# Altium project radxa_cm3s_io_board_v1510.PrjPcb
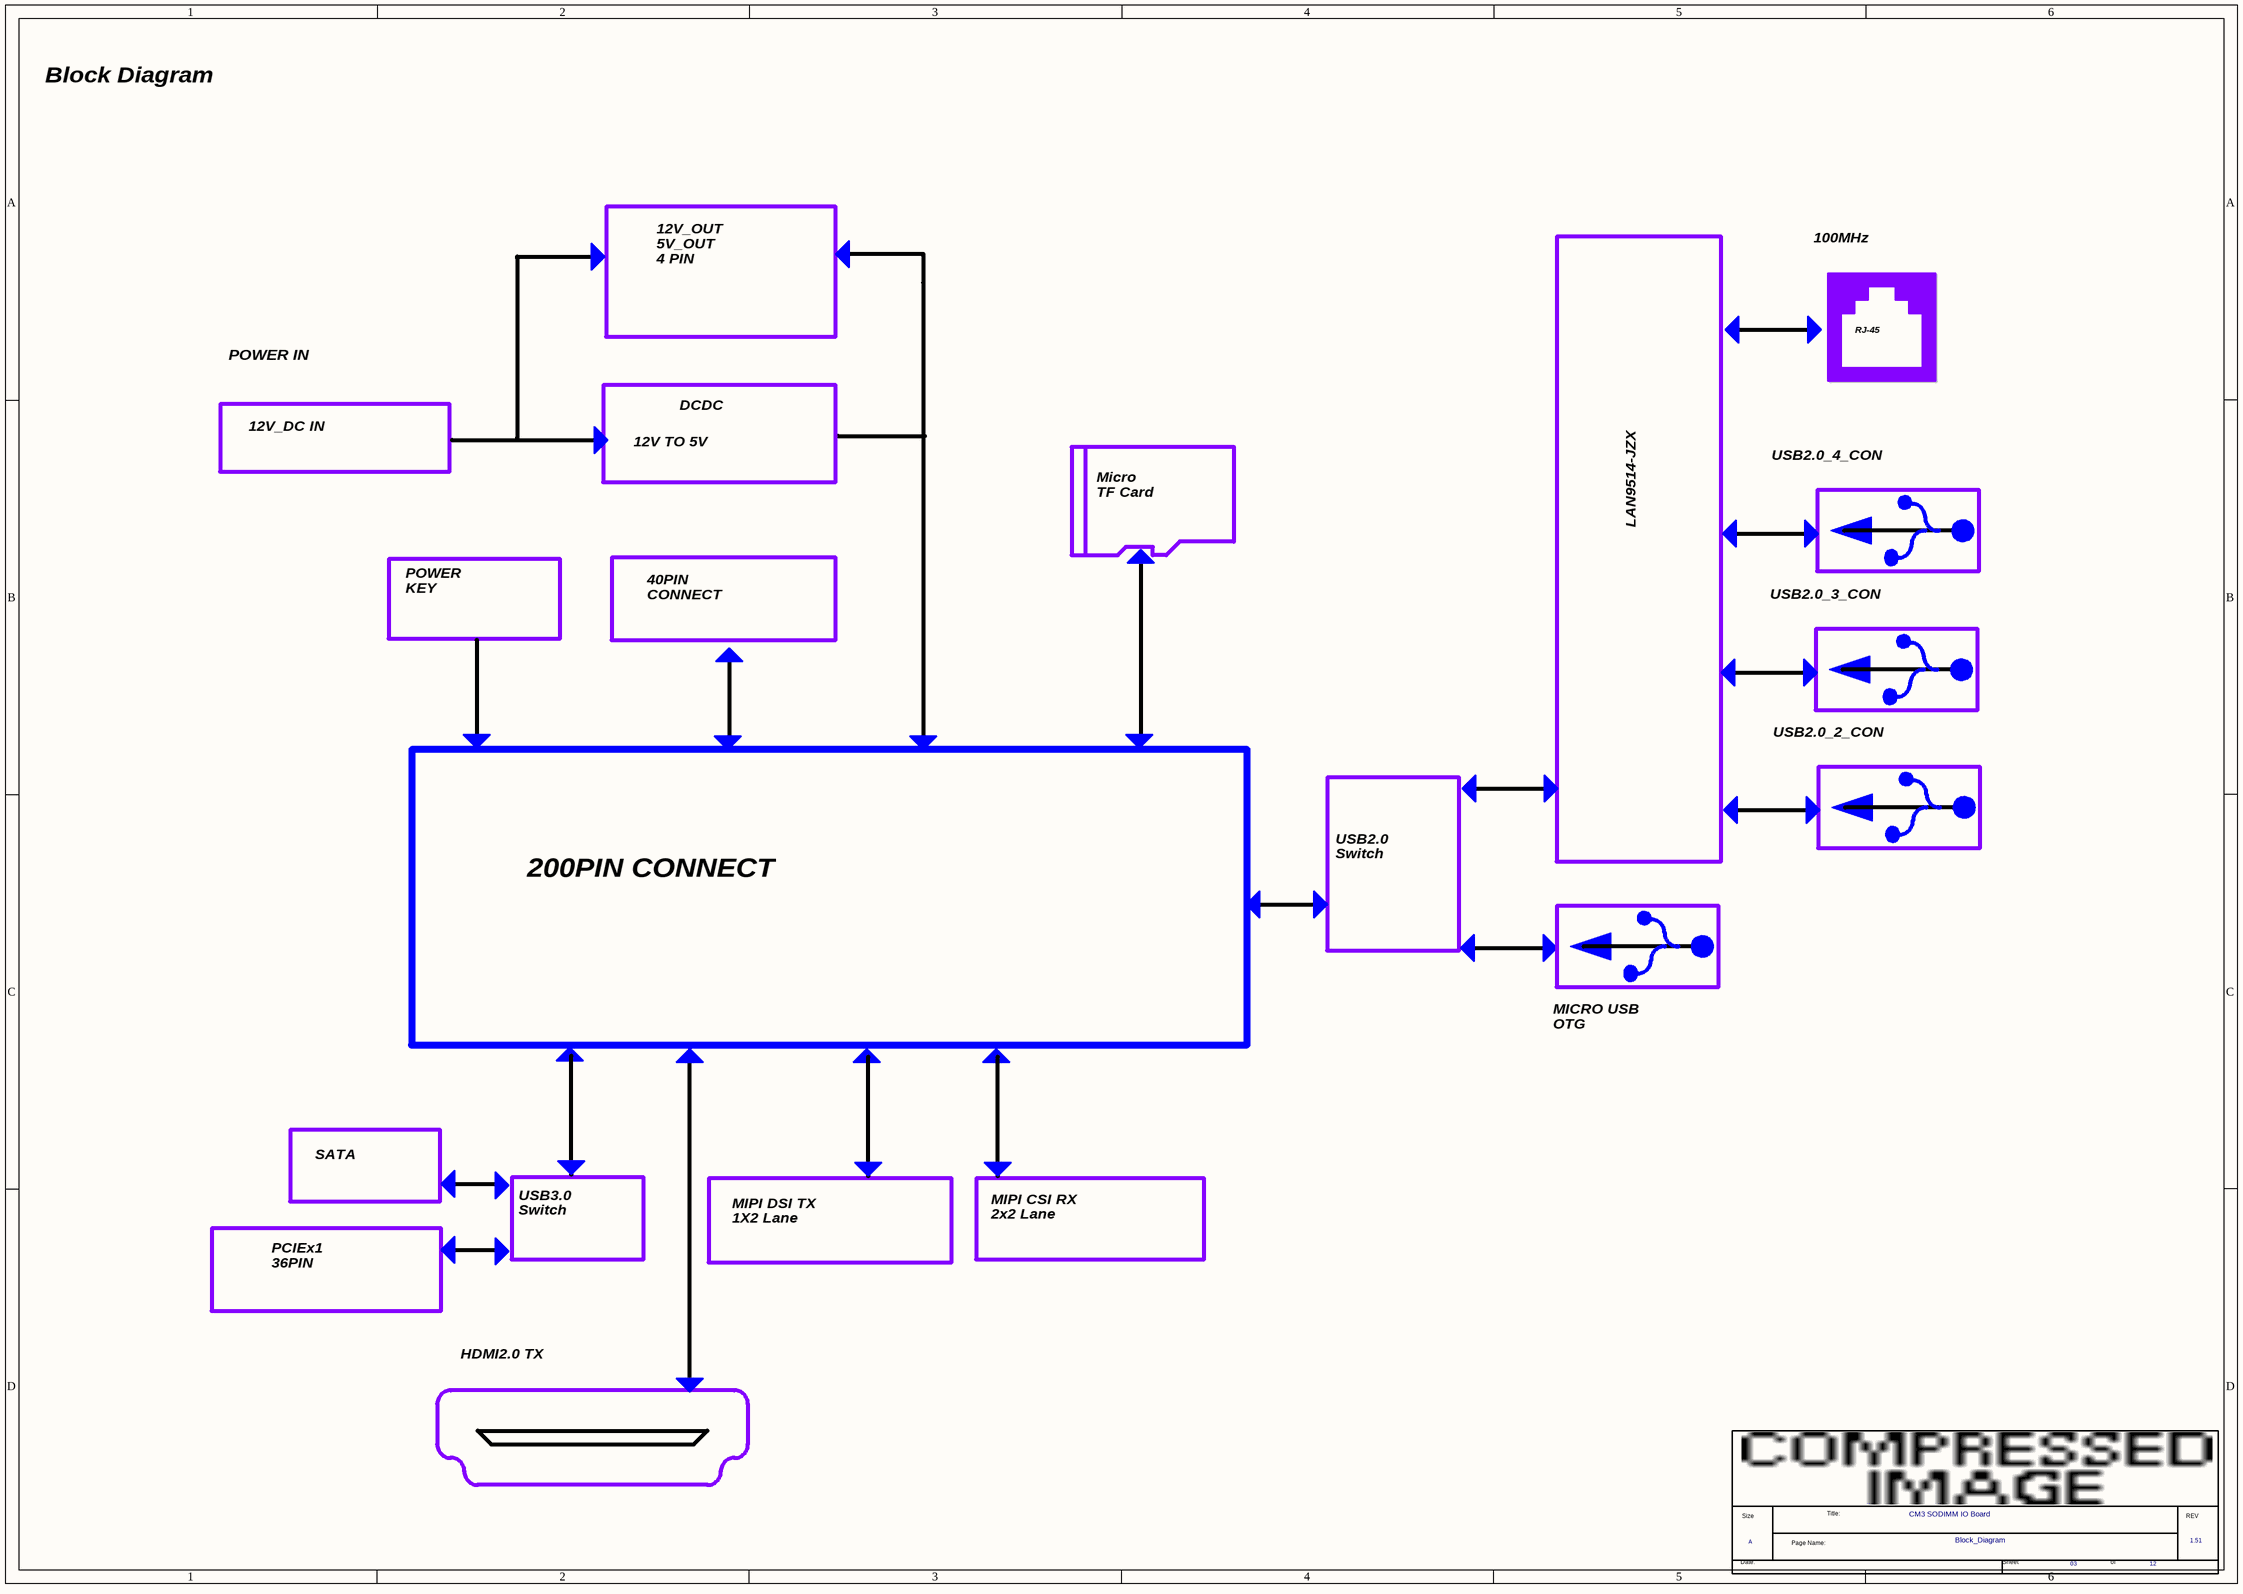
[diagram p0: 03.SchDoc]
7 sheets, 199 parts. Net scope: global (net labels, ports and power ports of the same name join across sheets).
Sheets:
  01.SchDoc
  03.SchDoc
  04.SchDoc
  06.SchDoc
  07.SchDoc
  08.SchDoc
  10.SchDoc

## Sheet 01.SchDoc
size 297 x 209 mm

## Sheet 03.SchDoc
size 420 x 297 mm

### Parts
(Parts that share a designator on the sheet are numbered #1, #2 ... from top to bottom, then left to right.)
*#1  Page Count: 12  Page Number: 03  Page Size: A  Title: CM3 SODIMM IO Board  RevCode: 1.51  Doc: Block_Diagram  (hidden comment: radxa_1010)  (graphical)

### Notes on the sheet
- Block Diagram
- 12V_OUT
  5V_OUT
  4 PIN
- 100MHz
- POWER IN
- RJ-45
- 12V_DC IN
- 12V TO 5V
- DCDC
- Micro
  TF Card
- USB2.0_4_CON
- LAN9514-JZX
- POWER
  KEY
- 40PIN
  CONNECT
- USB2.0_3_CON
- USB2.0_2_CON
- USB2.0
  Switch
- 200PIN CONNECT
- MICRO USB
  OTG
- SATA
- USB3.0
  Switch
- MIPI DSI TX
  1X2 Lane
- MIPI CSI RX
  2x2 Lane
- PCIEx1
  36PIN
- HDMI2.0 TX
- (in symbol radxa_1010) Title:; Size; REV; Page Name:; Date:; Sheet; of

### Library data of the parts
*#1 = radxa_1010: Page Create Date: March  8, 1995

## Sheet 04.SchDoc
size 297 x 209 mm
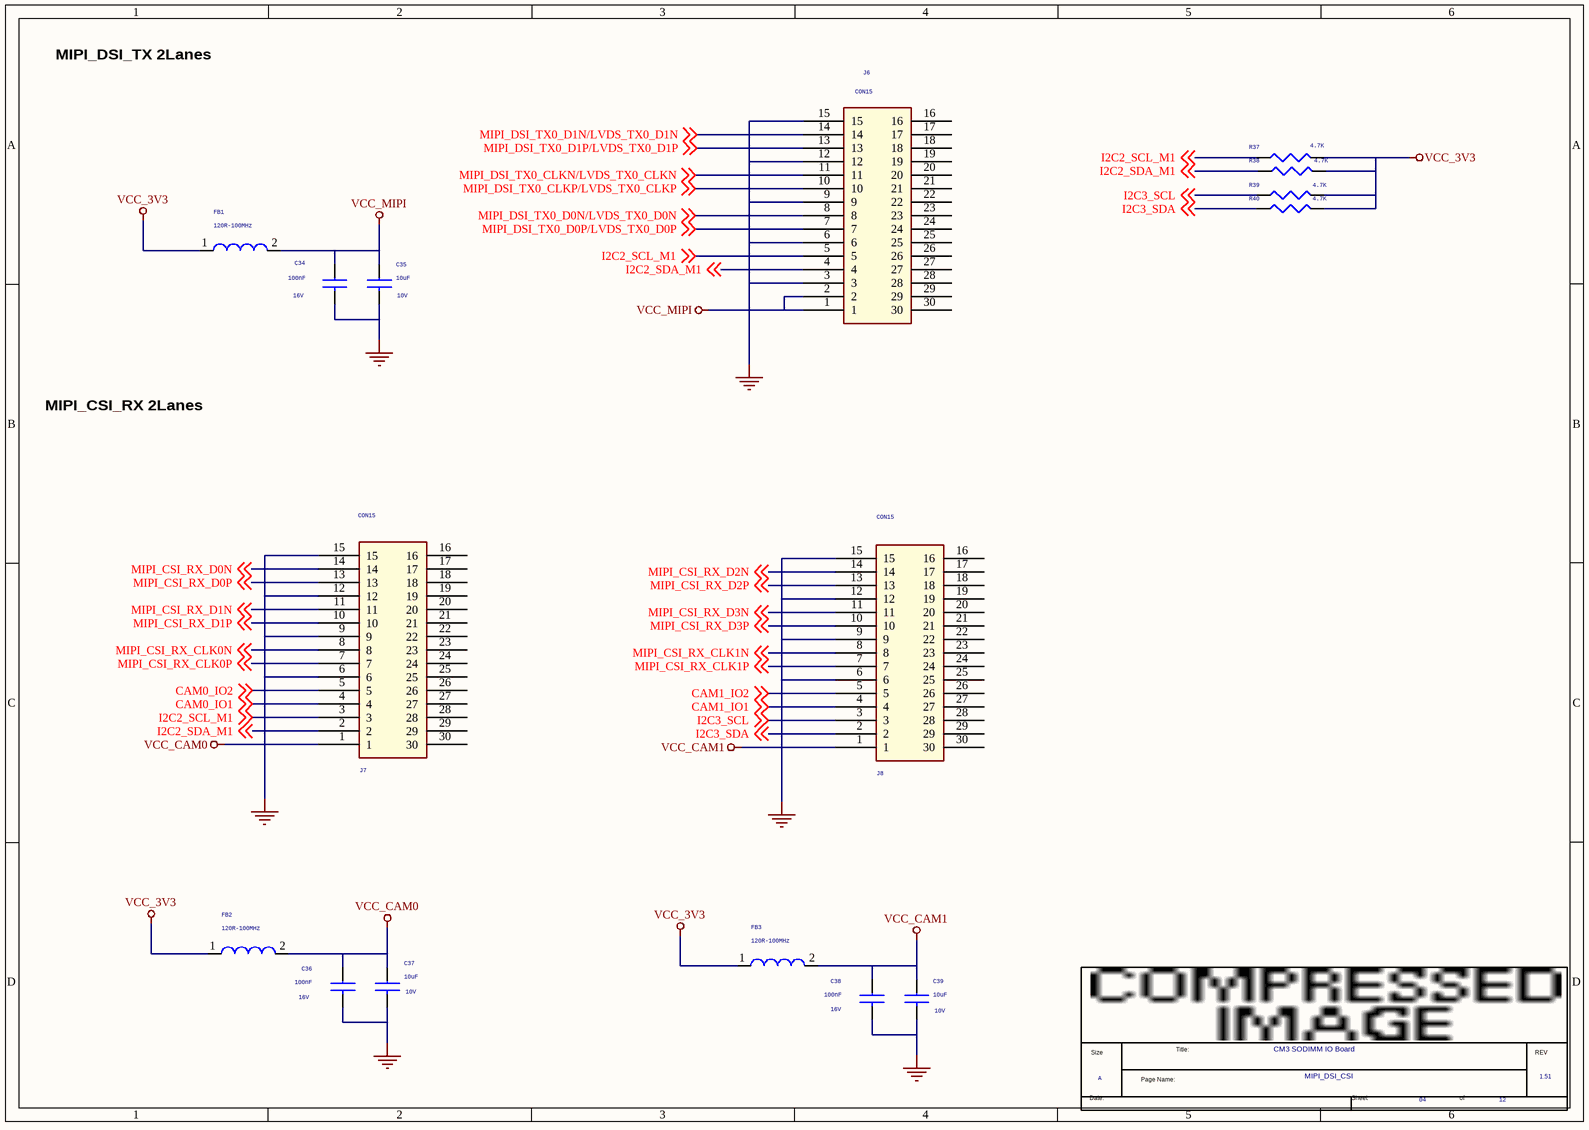
[diagram p1: 04.SchDoc]

### Parts
(Parts that share a designator on the sheet are numbered #1, #2 ... from top to bottom, then left to right.)
*#2  Page Count: 12  Page Number: 04  Page Size: A  Title: CM3 SODIMM IO Board  RevCode: 1.51  Doc: MIPI_DSI_CSI  (hidden comment: radxa_1010)  (graphical)
C34  100nF  Voltage: 16V  [C0402]
C35  10uF  Voltage: 10V  [C0603]
C36  100nF  Voltage: 16V  [C0402]
C37  10uF  Voltage: 10V  [C0603]
C38  100nF  Voltage: 16V  [C0402]
C39  10uF  Voltage: 10V  [C0603]
FB1  120R-100MHz  [L0402]
FB2  120R-100MHz  [L0402]
FB3  120R-100MHz  [L0402]
J6  CON15  [FPC15PIN-1.0MM-LS]
J7  CON15  [FPC15PIN-1.0MM-LS]
J8  CON15  [FPC15PIN-1.0MM-LS]
R37  4.7K  [R0402]
R38  4.7K  [R0402]
R39  4.7K  [R0402]
R40  4.7K  [R0402]

### Nets
GND: C34.2 C35.2 C36.2 C37.2 C38.2 C39.2 J6.3 J6.6 J6.9 J6.12 J6.15 J7.6 J7.9 J7.12 J7.15 J8.6 J8.9 J8.12 J8.15
VCC_3V3: FB1.1 FB2.1 FB3.1 R37.2 R38.2 R39.2 R40.2
VCC_CAM0: C36.1 C37.1 FB2.2 J7.1
VCC_CAM1: C38.1 C39.1 FB3.2 J8.1
VCC_MIPI: C34.1 C35.1 FB1.2 J6.1 J6.2
CAM0_IO1: J7.4 ; off-sheet CAM0_IO1
CAM0_IO2: J7.5 ; off-sheet CAM0_IO2
CAM1_IO1: J8.4 ; off-sheet CAM1_IO1
CAM1_IO2: J8.5 ; off-sheet CAM1_IO2
I2C2_SCL_M1: J6.5 J7.3 R37.1 ; off-sheet I2C2_SCL_M1
I2C2_SDA_M1: J6.4 J7.2 R38.1 ; off-sheet I2C2_SDA_M1
I2C3_SCL: J8.3 R39.1 ; off-sheet I2C3_SCL
I2C3_SDA: J8.2 R40.1 ; off-sheet I2C3_SDA
MIPI_CSI_RX_CLK0N: J7.8 ; off-sheet MIPI_CSI_RX_CLK0N
MIPI_CSI_RX_CLK0P: J7.7 ; off-sheet MIPI_CSI_RX_CLK0P
MIPI_CSI_RX_CLK1N: J8.8 ; off-sheet MIPI_CSI_RX_CLK1N
MIPI_CSI_RX_CLK1P: J8.7 ; off-sheet MIPI_CSI_RX_CLK1P
MIPI_CSI_RX_D0N: J7.14 ; off-sheet MIPI_CSI_RX_D0N
MIPI_CSI_RX_D0P: J7.13 ; off-sheet MIPI_CSI_RX_D0P
MIPI_CSI_RX_D1N: J7.11 ; off-sheet MIPI_CSI_RX_D1N
MIPI_CSI_RX_D1P: J7.10 ; off-sheet MIPI_CSI_RX_D1P
MIPI_CSI_RX_D2N: J8.14 ; off-sheet MIPI_CSI_RX_D2N
MIPI_CSI_RX_D2P: J8.13 ; off-sheet MIPI_CSI_RX_D2P
MIPI_CSI_RX_D3N: J8.11 ; off-sheet MIPI_CSI_RX_D3N
MIPI_CSI_RX_D3P: J8.10 ; off-sheet MIPI_CSI_RX_D3P
MIPI_DSI_TX0_CLKN/LVDS_TX0_CLKN: J6.11 ; off-sheet MIPI_DSI_TX0_CLKN/LVDS_TX0_CLKN
MIPI_DSI_TX0_CLKP/LVDS_TX0_CLKP: J6.10 ; off-sheet MIPI_DSI_TX0_CLKP/LVDS_TX0_CLKP
MIPI_DSI_TX0_D0N/LVDS_TX0_D0N: J6.8 ; off-sheet MIPI_DSI_TX0_D0N/LVDS_TX0_D0N
MIPI_DSI_TX0_D0P/LVDS_TX0_D0P: J6.7 ; off-sheet MIPI_DSI_TX0_D0P/LVDS_TX0_D0P
MIPI_DSI_TX0_D1N/LVDS_TX0_D1N: J6.14 ; off-sheet MIPI_DSI_TX0_D1N/LVDS_TX0_D1N
MIPI_DSI_TX0_D1P/LVDS_TX0_D1P: J6.13 ; off-sheet MIPI_DSI_TX0_D1P/LVDS_TX0_D1P

Not connected (* = marked no-connect by the designer): J6 16 17 18 19 20 21 22 23 24 25 26 27 28 29 30; J7 16 17 18 19 20 21 22 23 24 25 26 27 28 29 30; J8 16 17 18 19 20 21 22 23 24 25 26 27 28 29 30

### Notes on the sheet
- MIPI_DSI_TX 2Lanes
- MIPI_CSI_RX 2Lanes
- (in symbol radxa_1010) Title:; Size; REV; Page Name:; Date:; Sheet; of

### Library data of the parts
C34 C38 = CAP NP_0_Dup2: cap,100.00nF,+/-10%,16V,X5R,C0402; Manufacturer PN: C1005X5R1C104K050BA; Manufacturer: TDK; Tolerance: 10%; Priority: A; Dielectric: X5R; Created by: JJJ; Part Type: C0402; RK PN: C1005X5R1C104K050BA
C35 C37 = CAP NP_0: cap,10.00uF,+/-10%,10V,X5R,C0805; Manufacturer: TDK; RK PN: C2012X5R1A106K125AB; Priority: A; Tolerance: 10%; Dielectric: X5R; Part Type: C0805; Manufacturer PN: C2012X5R1A106K125AB; Created by: JJJ
C36 = CAP NP_0_Dup2: cap,100.00nF,+/-10%,16V,X5R,C0402; Manufacturer: TDK; RK PN: C1005X5R1C104K050BA; Priority: A; Tolerance: 10%; Dielectric: X5R; Part Type: C0402; Manufacturer PN: C1005X5R1C104K050BA; Created by: JJJ
C39 = CAP NP_0: cap,10.00uF,+/-10%,10V,X5R,C0805; Manufacturer PN: C2012X5R1A106K125AB; Manufacturer: TDK; Tolerance: 10%; Priority: A; Dielectric: X5R; Created by: JJJ; Part Type: C0805; RK PN: C2012X5R1A106K125AB
FB1 FB2 = BEAD: BEAD,120R@100MHz,current=2000mA,0603; Manufacturer PN: BLM18KG121TN1; Manufacturer: Murata; Irms: 2A; Tolerance: 25%; DC Resistor: 0.030ohm; Priority: L; Created by: DZS; Part Type: BEAD; RK PN: BLM18KG121TN1
FB3 = BEAD: BEAD,120R@100MHz,current=2000mA,0603; Manufacturer: Murata; Irms: 2A; Tolerance: 25%; DC Resistor: 0.030ohm; RK PN: BLM18KG121TN1; Priority: L; Part Type: BEAD; Manufacturer PN: BLM18KG121TN1; Created by: DZS
J6 = CON15_4
J7 J8 = CON15_5
R37 R39 R40 = RESISTOR_0: 通用厚膜电阻,0R,+/-5%,R0402,1/16W.; Manufacturer: YAGEO; Tolerance: 5%; RK PN: RC0402JR-070RL; Priority: A; Wattage: 1/16W; Option: DNP; Part Type: 通用厚膜电阻; Manufacturer PN: RC0402JR-070RL; Created by: YTL
R38 = RESISTOR_0: 通用厚膜电阻,0R,+/-5%,R0402,1/16W.; Manufacturer PN: RC0402JR-070RL; Manufacturer: YAGEO; Tolerance: 5%; Option: DNP; Wattage: 1/16W; Priority: A; Created by: YTL; Part Type: 通用厚膜电阻; RK PN: RC0402JR-070RL
*#2 = radxa_1010: Page Create Date: March  8, 1995

## Sheet 06.SchDoc
size 386 x 246 mm
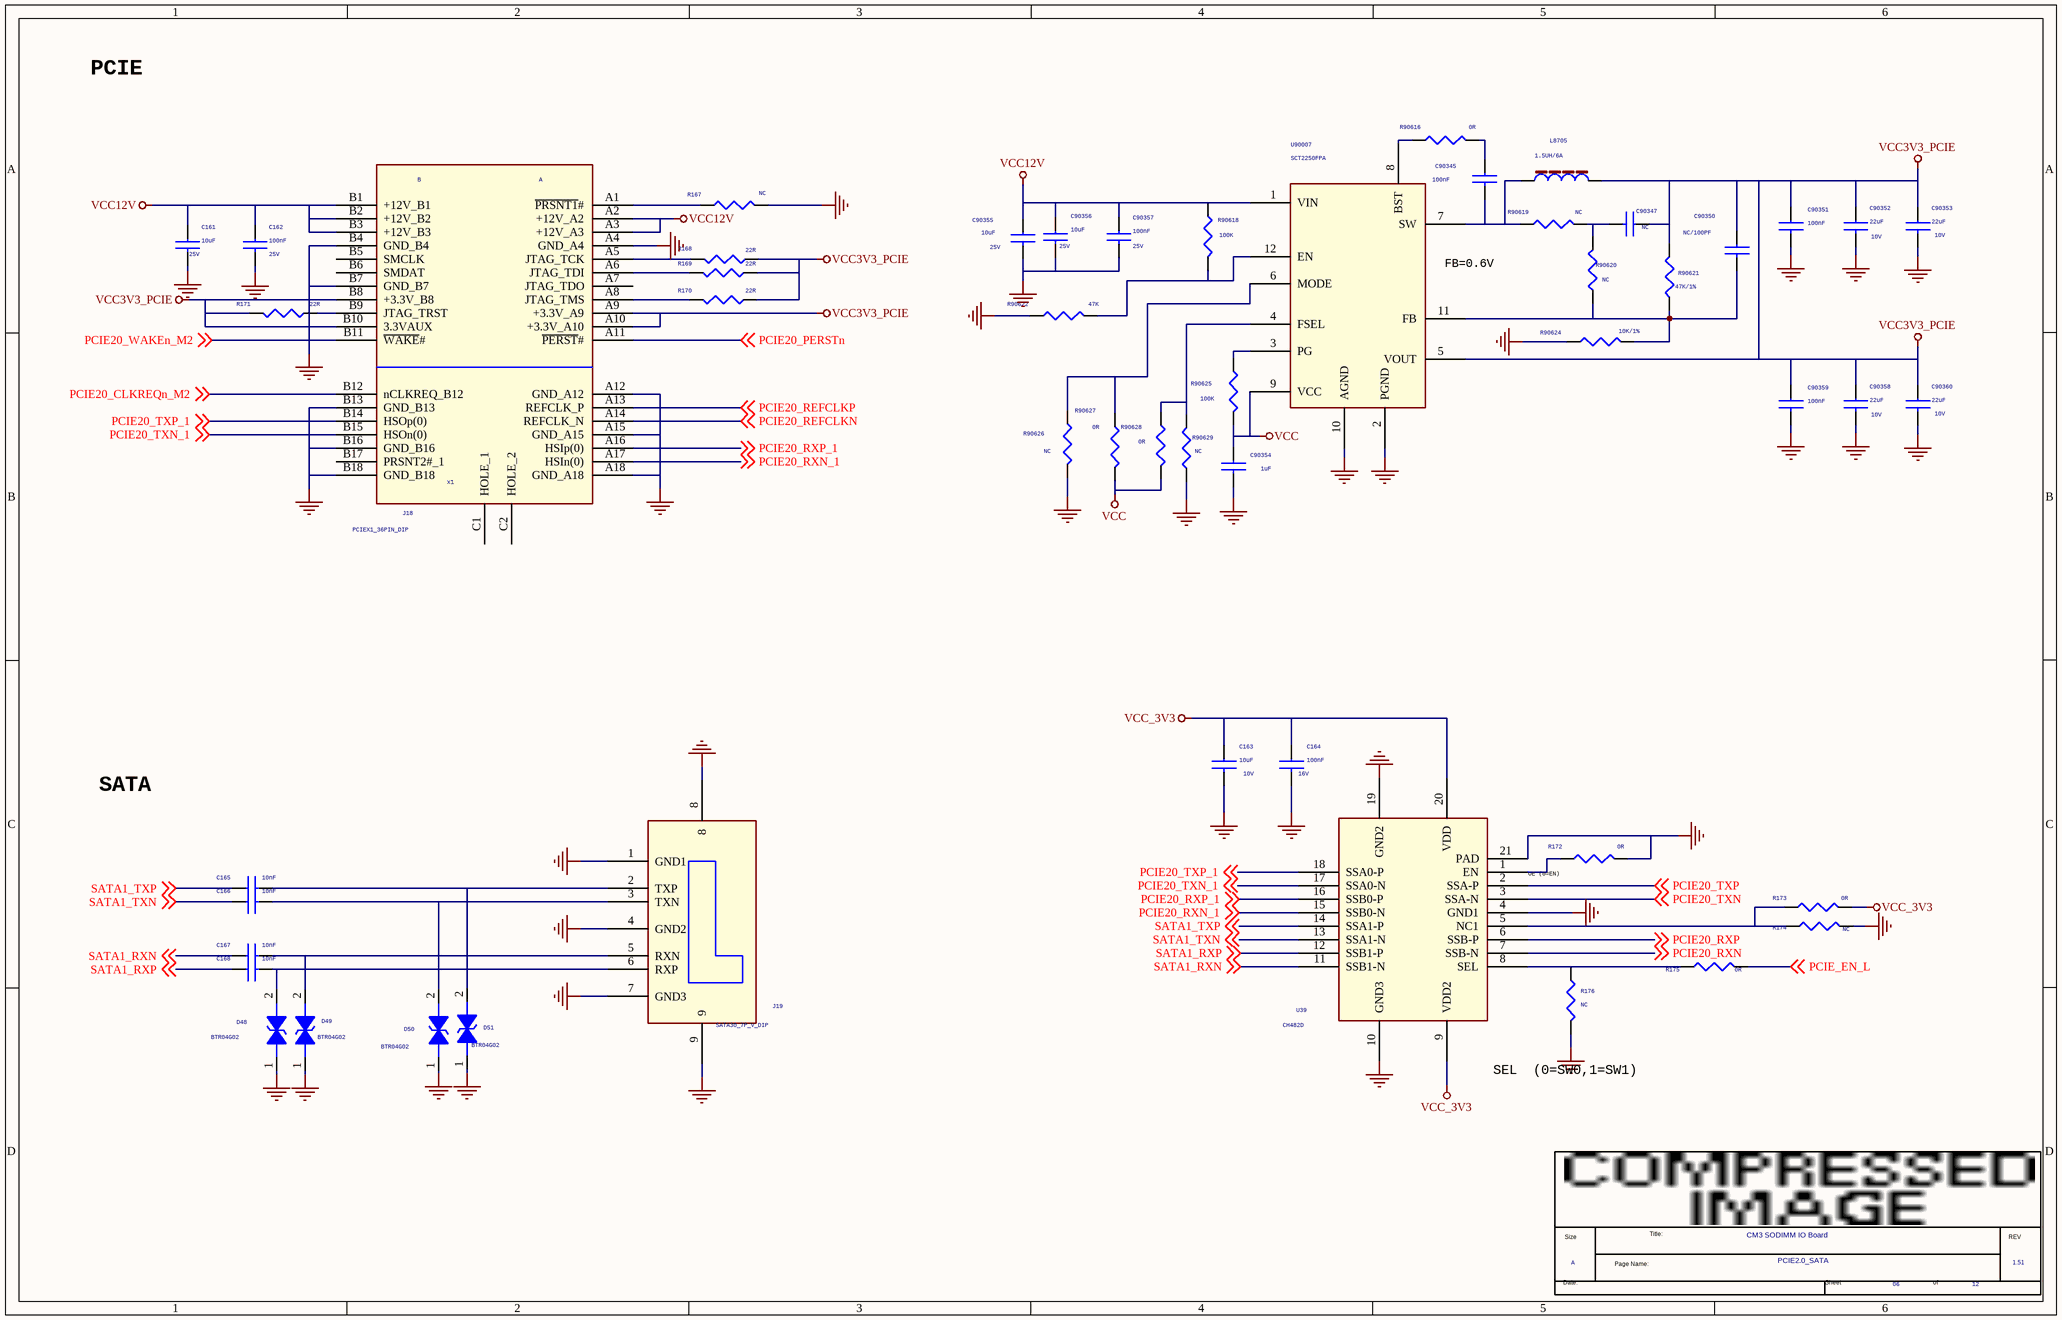
[diagram p2: 06.SchDoc]

### Parts
(Parts that share a designator on the sheet are numbered #1, #2 ... from top to bottom, then left to right.)
*#3  Page Count: 12  Page Number: 06  Page Size: A  Title: CM3 SODIMM IO Board  RevCode: 1.51  Doc: PCIE2.0_SATA  (hidden comment: radxa_1010)  (graphical)
C161  10uF  Voltage: 25V  [C1206]
C162  100nF  Voltage: 25V  [C0402]
C163  10uF  Voltage: 10V  [C0603]
C164  100nF  Voltage: 16V  [C0402]
C165  10nF  [C0402]
C166  10nF  [C0402]
C167  10nF  [C0402]
C168  10nF  [C0402]
C90345  100nF  [C0201]
C90347  NC  [C0201]
C90350  NC/100PF  [C0201]
C90351  100nF  [C0201]
C90352  22uF  Voltage: 10V  [C0603]
C90353  22uF  Voltage: 10V  [C0603]
C90354  1uF  [C0201]
C90355  10uF  Voltage: 25V  [C0805]
C90356  10uF  Voltage: 25V  [C0805]
C90357  100nF  Voltage: 25V  [C0402]
C90358  22uF  Voltage: 10V  [C0603]
C90359  100nF  [C0201]
C90360  22uF  Voltage: 10V  [C0603]
D48  BTR04G02  [ESD0402_1xD5]
D49  BTR04G02  [ESD0402_1xD5]
D50  BTR04G02  [ESD0402_1xD5]
D51  BTR04G02  [ESD0402_1xD5]
J18  PCIEX1_36PIN_DIP  [PCIEX1_36PIN_DIP]
J19  SATA30_7P_V_DIP  [SMD_SATA_7P_50_180]
L8705  1.5UH/6A  [IND-5X5]
R167  NC  [R0402]
R168  22R  [R0402]
R169  22R  [R0402]
R170  22R  [R0402]
R171  22R  [R0402]
R172  0R  [R0402]
R173  0R  [R0402]
R174  NC  [R0402]
R175  0R  [R0402]
R176  NC  [R0402]
R90616  0R  [R0402]
R90618  100K  [R0402]
R90619  NC  [R0402]
R90620  NC  [R0402]
R90621  47K/1%  [R0402]
R90622  47K  [R0402]
R90624  10K/1%  [R0402]
R90625  100K  [R0402]
R90626  NC  [R0402]
R90627  0R  [R0402]
R90628  0R  [R0402]
R90629  NC  [R0402]
U39  CH482D  [CH482X]
U90007  SCT2250FPA  [QFN12_3R00X2R00X0R90]

### Nets
GND: C161.2 C162.2 C163.2 C164.2 C90351.2 C90352.2 C90353.2 C90354.2 C90355.2 C90356.2 C90357.2 C90358.2 C90359.2 C90360.2 D48.1 D49.1 D50.1 D51.1 J18.A4(GND_A4) J18.A12(GND_A12) J18.A15(GND_A15) J18.A18(GND_A18) J18.B4(GND_B4) J18.B7(GND_B7) J18.B13(GND_B13) J18.B16(GND_B16) J18.B18(GND_B18) J19.1(GND1) J19.4(GND2) J19.7(GND3) J19.8 J19.9 R167.2 R172.1 R174.1 R176.2 R90622.2 R90624.2 R90626.1 R90629.1 U39.4(GND1) U39.10(GND3) U39.19(GND2) U39.21(PAD) U90007.2(PGND) U90007.10(AGND)
VCC: C90354.1 R90625.1 R90627.1 R90628.1 U90007.9(VCC)
VCC3V3_PCIE: C90347.1 C90350.1 C90351.1 C90352.1 C90353.1 C90358.1 C90359.1 C90360.1 J18.A9(+3.3V_A9) J18.A10(+3.3V_A10) J18.B8(+3.3V_B8) J18.B10(3.3VAUX) L8705.2 R168.2 R169.2 R170.2 R171.1 R90621.2 U90007.5(VOUT)
VCC12V: C161.1 C162.1 C90355.1 C90356.1 C90357.1 J18.A2(+12V_A2) J18.A3(+12V_A3) J18.B1(+12V_B1) J18.B2(+12V_B2) J18.B3(+12V_B3) R90618.2 U90007.1(VIN)
VCC_3V3: C163.1 C164.1 R173.1 U39.9(VDD2) U39.20(VDD)
PCIE20_CLKREQn_M2: J18.B12(nCLKREQ_B12) ; off-sheet PCIE20_CLKREQn_M2
PCIE20_PERSTn: J18.A11(~{PERST}#) ; off-sheet PCIE20_PERSTn
PCIE20_REFCLKN: J18.A14(REFCLK_N) ; off-sheet PCIE20_REFCLKN
PCIE20_REFCLKP: J18.A13(REFCLK_P) ; off-sheet PCIE20_REFCLKP
PCIE20_RXN: U39.7(SSB-N) ; off-sheet PCIE20_RXN
PCIE20_RXN_1: J18.A17(HSIn(0)) U39.15(SSB0-N) ; off-sheet PCIE20_RXN_1
PCIE20_RXP: U39.6(SSB-P) ; off-sheet PCIE20_RXP
PCIE20_RXP_1: J18.A16(HSIp(0)) U39.16(SSB0-P) ; off-sheet PCIE20_RXP_1
PCIE20_TXN: U39.3(SSA-N) ; off-sheet PCIE20_TXN
PCIE20_TXN_1: J18.B15(HSOn(0)) U39.17(SSA0-N) ; off-sheet PCIE20_TXN_1
PCIE20_TXP: U39.2(SSA-P) ; off-sheet PCIE20_TXP
PCIE20_TXP_1: J18.B14(HSOp(0)) U39.18(SSA0-P) ; off-sheet PCIE20_TXP_1
PCIE20_WAKEn_M2: J18.B11(~{WAKE}#) ; off-sheet PCIE20_WAKEn_M2
PCIE_EN_L: R175.1 ; off-sheet PCIE_EN_L
SATA1_RXN: C167.1 U39.11(SSB1-N) ; off-sheet SATA1_RXN
SATA1_RXP: C168.1 U39.12(SSB1-P) ; off-sheet SATA1_RXP
SATA1_TXN: C166.1 U39.13(SSA1-N) ; off-sheet SATA1_TXN
SATA1_TXP: C165.1 U39.14(SSA1-P) ; off-sheet SATA1_TXP
NetC165_2: C165.2 D51.2 J19.2(TXP)
NetC166_2: C166.2 D50.2 J19.3(TXN)
NetC167_2: C167.2 D49.2 J19.5(RXN)
NetC168_2: C168.2 D48.2 J19.6(RXP)
NetC90345_1: C90345.1 R90616.1
NetC90345_2: C90345.2 L8705.1 R90619.2 U90007.7(SW)
NetC90347_2: C90347.2 R90619.1 R90620.2
NetC90350_2: C90350.2 R90620.1 R90621.1 R90624.1 U90007.11(FB)
NetJ18_A1: J18.A1(~{PRSNT1}#) R167.1
NetJ18_A5: J18.A5(JTAG_TCK) R168.1
NetJ18_A6: J18.A6(JTAG_TDI) R169.1
NetJ18_A8: J18.A8(JTAG_TMS) R170.1
NetJ18_B9: J18.B9(JTAG_TRST) R171.2
NetR172_2: R172.2 U39.1(EN)
NetR173_2: R173.2 R174.2 U39.5(NC1)
NetR175_2: R175.2 R176.1 U39.8(SEL)
NetR90616_2: R90616.2 U90007.8(BST)
NetR90618_1: R90618.1 R90622.1 U90007.12(EN)
NetR90625_2: R90625.2 U90007.3(PG)
NetR90626_2: R90626.2 R90627.2 U90007.6(MODE)
NetR90628_2: R90628.2 R90629.2 U90007.4(FSEL)

Not connected (* = marked no-connect by the designer): J18 A7(JTAG_TDO) B5(SMCLK) B6(SMDAT) B17(PRSNT2#_1) C1(HOLE_1) C2(HOLE_2)

### Notes on the sheet
- PCIE
- (near U90007) FB=0.6V
- SATA
- (near R172) OE (0=EN)
- SEL  (0=SW0,1=SW1)
- (in symbol PCIE_4X_CON_1) B; x1
- (in symbol radxa_1010) Size; Title:; REV; Page Name:; Date:; Sheet; of

### Library data of the parts
C161 C90355 C90356 = CAP NP_0: cap,10.00uF,+/-10%,25V,X5R,C1206; Manufacturer PN: C3216X5R1E106K085AC; Manufacturer: TDK; Tolerance: 10%; C_Voltage: 6.3V; Priority: A; Dielectric: X5R; Created by: JJJ; Part Type: C1206; RK PN: C3216X5R1E106K085AC
C162 C90357 = CAP NP_0: cap,100.00nF,+/-10%,25V,X5R,C0402; Manufacturer: TDK; RK PN: C1005X5R1E104K050BC; Priority: A; Tolerance: 10%; Dielectric: X5R; Part Type: C0402; Manufacturer PN: C1005X5R1E104K050BC; Created by: JJJ
C163 = CAP NP_0: cap,22.00uF,+/-10%,10V,X5R,C0805; Manufacturer PN: C2012X5R1A226K125AB; Manufacturer: TDK; Tolerance: 10%; Priority: A; Dielectric: X5R; Created by: JJJ; Part Type: C0805; RK PN: C2012X5R1A226K125AB
C164 = CAP NP_0: cap,100.00nF,+/-10%,16V,X5R,C0402; Manufacturer PN: C1005X5R1C104K050BA; Manufacturer: TDK; Tolerance: 10%; Priority: A; Dielectric: X5R; Created by: JJJ; Part Type: C0402; RK PN: C1005X5R1C104K050BA
C165-C168 = CAP NP_0: cap,10.00nF,+/-10%,10V,X7R,C0201; Manufacturer: TDK; RK PN: C0603X7R1A103K030BA; Priority: A; Tolerance: 10%; Dielectric: X7R; Voltage: 10V; Part Type: C0201; Manufacturer PN: C0603X7R1A103K030BA; Created by: JJJ
C90345 C90347 C90350 C90351 C90354 C90359 = CAP NP_0_Dup1: Priority: A
C90352 C90353 = CAP NP_0_Dup1: cap,22.00uF,+/-10%,10V,X5R,C0805; Manufacturer: TDK; RK PN: C2012X5R1A226K125AB; Priority: A; Tolerance: 10%; Dielectric: X5R; Part Type: C0805; Manufacturer PN: C2012X5R1A226K125AB; Created by: JJJ
C90358 C90360 = CAP NP_0_Dup1: cap,22.00uF,+/-10%,10V,X5R,C0805; Manufacturer PN: C2012X5R1A226K125AB; Manufacturer: TDK; Tolerance: 10%; Priority: A; Dielectric: X5R; Created by: JJJ; Part Type: C0805; RK PN: C2012X5R1A226K125AB
D48 = DIODE BI_DIR TRIG: 1-Line, Bi-directional, Transient Voltage Suppressors.17.5pF.; Manufacturer PN: ESD5451N; Manufacturer: WillSemi(韦尔半导体); OPTION: DNP; Priority: A; Created by: JJJ; Part Type: ESD_TVS; RK PN: ESD5451N
D49-D51 = DIODE BI_DIR TRIG: 1-Line, Bi-directional, Transient Voltage Suppressors.17.5pF.; Manufacturer: WillSemi(韦尔半导体); RK PN: ESD5451N; Priority: A; OPTION: DNP; Part Type: ESD_TVS; Manufacturer PN: ESD5451N; Created by: JJJ
J18 = PCIE_4X_CON_1: PCIE 4X座子，立式，SMT；; Manufacturer Part Number: PCIE64_SMT; Priority: A; Part Type: PCIE; RK PN: PCIE64_SMT
J19 = SATA_DIP_1
L8705 = INDUCTOR_2: A: TMPC0402HG-1R5M
R167 = RESISTOR_0: 通用厚膜电阻,0R,+/-5%,R0402,1/16W.; Manufacturer: YAGEO; Tolerance: 5%; RK PN: RC0402JR-070RL; Priority: A; Wattage: 1/16W; Part Type: 通用厚膜电阻; Manufacturer PN: RC0402JR-070RL; Created by: YTL
R168-R171 = RESISTOR_0: 通用厚膜电阻,10K,+/-5%,R0402,1/16W.; Manufacturer PN: RC0402JR-0710KL; Manufacturer: YAGEO; Tolerance: 5%; Wattage: 1/16W; Priority: A; Created by: YTL; Part Type: 通用厚膜电阻; RK PN: RC0402JR-0710KL
R172-R174 = RESISTOR_0: 通用厚膜电阻,0R,+/-5%,R0402,1/16W.; Manufacturer PN: RC0402JR-070RL; Manufacturer: YAGEO; Tolerance: 5%; Wattage: 1/16W; Priority: A; Created by: YTL; Part Type: 通用厚膜电阻; RK PN: RC0402JR-070RL
R175 = RESISTOR_0: 通用厚膜电阻,100R,+/-5%,R0402,1/16W.; Manufacturer: YAGEO; Tolerance: 5%; RK PN: RC0402JR-07100RL; Priority: A; Wattage: 1/16W; Part Type: 通用厚膜电阻; Manufacturer PN: RC0402JR-07100RL; Created by: YTL
R176 = RESISTOR_0: 通用厚膜电阻,4K7,+/-5%,R0402,1/16W.; Manufacturer PN: RC0402JR-074K7L; Manufacturer: YAGEO; Tolerance: 5%; Wattage: 1/16W; Priority: A; Created by: YTL; Part Type: 通用厚膜电阻; RK PN: RC0402JR-074K7L
R90616 R90618-R90622 R90624-R90629 = RESISTOR_0_Dup2: Priority: A
U39 = CH482X
U90007 = DCDC_NB679_4: 26 V, Low Iq, High Current, Fixed 5 V-8 A Synchronous Buck Converter with 100 mA LDO;; Manufacturer: MPS （美国芯源）; RK PN: NB679GD; Priority: A; Part Type: DCDC; Manufacturer PN: NB679GD; Created by: JJJ
*#3 = radxa_1010: Page Create Date: March  8, 1995

## Sheet 07.SchDoc
size 297 x 209 mm
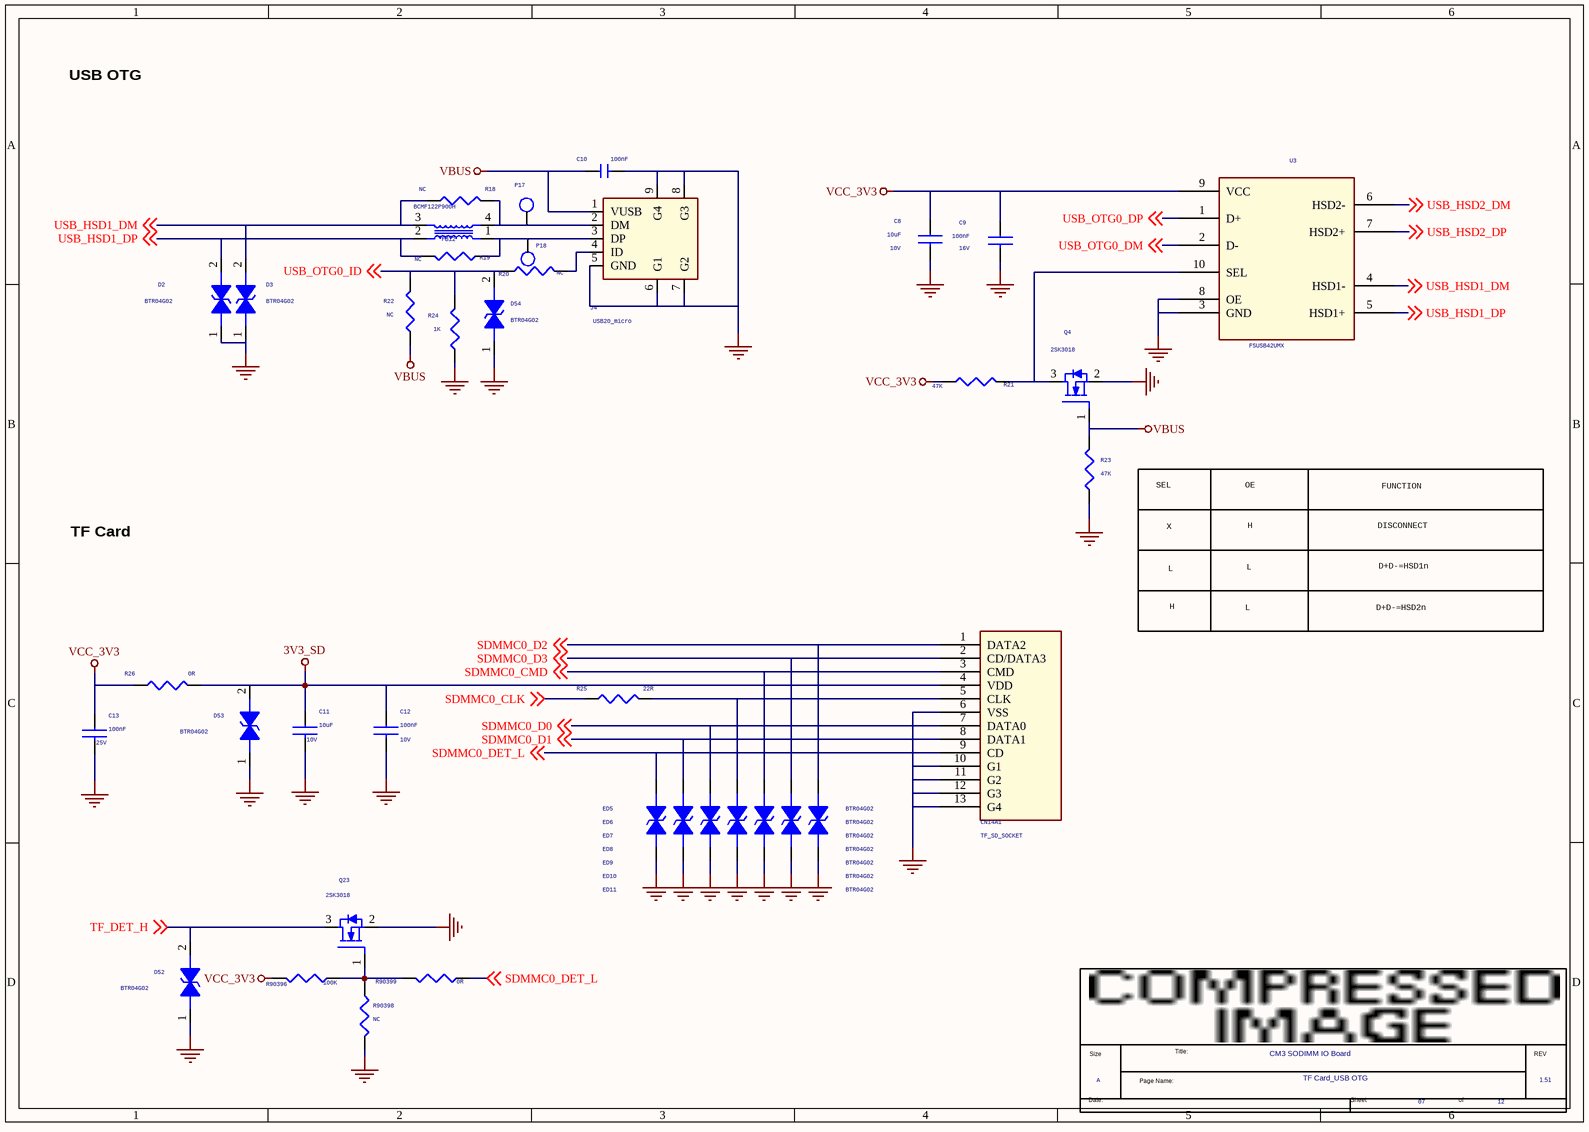
[diagram p3: 07.SchDoc]

### Parts
(Parts that share a designator on the sheet are numbered #1, #2 ... from top to bottom, then left to right.)
*#4  Page Count: 12  Page Number: 07  Page Size: A  Title: CM3 SODIMM IO Board  RevCode: 1.51  Doc: TF Card_USB OTG  (hidden comment: radxa_1010)  (graphical)
C8  10uF  Voltage: 10V  [C0603]
C9  100nF  Voltage: 16V  [C0402]
C10  100nF  [C0603]
C11  10uF  Voltage: 10V  [C0603]
C12  100nF  Voltage: 10V  [C0402]
C13  100nF  Voltage: 25V  [C0402]
CN14A1  TF_SD_SOCKET  [TF-CKT01-009D]
D2  BTR04G02  [ESD0402_1xD5]
D3  BTR04G02  [ESD0402_1xD5]
D52  BTR04G02  [ESD0402_1xD5]
D53  BTR04G02  [ESD0402_1xD5]
D54  BTR04G02  [ESD0402_1xD5]
ED5  BTR04G02  [ESD0402_1xD5]
ED6  BTR04G02  [ESD0402_1xD5]
ED7  BTR04G02  [ESD0402_1xD5]
ED8  BTR04G02  [ESD0402_1xD5]
ED9  BTR04G02  [ESD0402_1xD5]
ED10  BTR04G02  [ESD0402_1xD5]
ED11  BTR04G02  [ESD0402_1xD5]
FB12  BCMF122P900H  [GMDG-4PIN_ESD]
J4  USB20_micro  [USB-5PAA]
P17  TEST  [TEST]  (value not drawn)
P18  TEST  [TEST]  (value not drawn)
Q4  2SK3018  [SOT23]
Q23  2SK3018  [SOT23]
R18  NC  [R0402]
R19  NC  [R0402]
R20  NC  [R0402]
R21  47K  [R0402]
R22  NC  [R0402]
R23  47K  [R0402]
R24  1K  [R0603]
R25  22R  [R0402]
R26  0R  [R0402]
R90396  100K  [R0201]
R90398  NC  [R0402]
R90399  0R  [R0201]
U3  FSUSB42UMX  [UMLP-10]

### Nets
3V3_SD: C11.1 C12.1 CN14A1.4(VDD) D53.2 R26.2
GND: C8.2 C9.2 C10.2 C11.2 C12.2 C13.2 CN14A1.6(VSS) CN14A1.10(G1) CN14A1.11(G2) CN14A1.12(G3) CN14A1.13(G4) D2.1 D3.1 D52.1 D53.1 D54.1 ED5.2 ED6.2 ED7.2 ED8.2 ED9.2 ED10.2 ED11.2 J4.5(GND) J4.6(G1) J4.7(G2) J4.8(G3) J4.9(G4) Q4.2(SOURCE) Q23.2(SOURCE) R23.2 R24.2 R90398.2 U3.3(GND) U3.8(OE)
VBUS: C10.1 J4.1(VUSB) Q4.1(GATE) R22.2 R23.1
VCC_3V3: C8.1 C9.1 C13.1 R21.2 R26.1 R90396.2 U3.9(VCC)
SDMMC0_CLK: R25.1 ; off-sheet SDMMC0_CLK
SDMMC0_CMD: CN14A1.3(CMD) ED9.1 ; off-sheet SDMMC0_CMD
SDMMC0_D0: CN14A1.7(DATA0) ED7.1 ; off-sheet SDMMC0_D0
SDMMC0_D1: CN14A1.8(DATA1) ED6.1 ; off-sheet SDMMC0_D1
SDMMC0_D2: CN14A1.1(DATA2) ED11.1 ; off-sheet SDMMC0_D2
SDMMC0_D3: CN14A1.2(CD/DATA3) ED10.1 ; off-sheet SDMMC0_D3
SDMMC0_DET_L: CN14A1.9(CD) ED5.1 R90399.1 ; off-sheet SDMMC0_DET_L
TF_DET_H: D52.2 Q23.3(DRAIN) ; off-sheet TF_DET_H
USB_HSD1_DM: D3.2 FB12.3(R3) R18.2 U3.4(HSD1-) ; off-sheet USB_HSD1_DM
USB_HSD1_DP: D2.2 FB12.2(R4) R19.2 U3.5(HSD1+) ; off-sheet USB_HSD1_DP
USB_HSD2_DM: U3.6(HSD2-) ; off-sheet USB_HSD2_DM
USB_HSD2_DP: U3.7(HSD2+) ; off-sheet USB_HSD2_DP
USB_OTG0_DM: U3.2(D-) ; off-sheet USB_OTG0_DM
USB_OTG0_DP: U3.1(D+) ; off-sheet USB_OTG0_DP
USB_OTG0_ID: D54.2 R20.2 R22.1 R24.1 ; off-sheet USB_OTG0_ID
NetCN14A1_5: CN14A1.5(CLK) ED8.1 R25.2
NetFB12_1: FB12.1(R1) J4.3(DP) P18.1 R19.1
NetFB12_4: FB12.4(R2) J4.2(DM) P17.1 R18.1
NetJ4_4: J4.4(ID) R20.1
NetQ4_3: Q4.3(DRAIN) R21.1 U3.10(SEL)
NetQ23_1: Q23.1(GATE) R90396.1 R90398.1 R90399.2

### Notes on the sheet
- USB OTG
- TF Card
- SEL
- X
- OE
- H
- DISCONNECT
- FUNCTION
- L
- D+D-=HSD2n
- D+D-=HSD1n
- (in symbol radxa_1010) Title:; Size; REV; Page Name:; Date:; Sheet; of

### Library data of the parts
C8 C11 = CAP NP_0: cap,10.00uF,+/-10%,10V,X5R,C0603; Manufacturer: TDK; RK PN: C1608X5R1A106K080AC; Priority: A; C_Voltage: 6.3V; Tolerance: 10%; Dielectric: X5R; Part Type: C0603; Manufacturer PN: C1608X5R1A106K080AC; Created by: JJJ
C9 C13 = CAP NP_0: cap,100.00nF,+/-10%,16V,X5R,C0402; Manufacturer: TDK; RK PN: C1005X5R1C104K050BA; Priority: A; Tolerance: 10%; Dielectric: X5R; Part Type: C0402; Manufacturer PN: C1005X5R1C104K050BA; Created by: JJJ
C10 = CAP_0.1uF_0603
C12 = CAP NP_0: cap,100.00nF,+/-10%,10V,X5R,C0402; Manufacturer: TDK; RK PN: C1005X5R1A104K050BA; Priority: A; Tolerance: 10%; C_Voltage: 6.3V; Dielectric: X5R; Part Type: C0402; Manufacturer PN: C1005X5R1A104K050BA; Created by: JJJ
CN14A1 = SD_SOCKET_0
D2 D52 D54 = DIODE BI_DIR TRIG: as D48 on sheet 06; Created by: JJJ; Part Type: ESD_TVS; RK PN: ESD5451N
D3 D53 = DIODE BI_DIR TRIG: as D49 on sheet 06; Part Type: ESD_TVS; Manufacturer PN: ESD5451N; Created by: JJJ
ED5-ED11 = DIODE BI-DIR TRIG: ESD
FB12 = R-PACK4_3
J4 = USB20_MICRO: micro型USB2.0座，卧式，贴焊; Manufacturer: 祺华电子; Priority: A; RK PN: USB20_micro; Part Type: USB Jack; Manufacturer Part Number: USB20_micro; Created by: JJJ
P17 P18 = TESTPOINT1
Q4 = MOSFET N: NMOS,2SK3018,SOT_323,Id=0.1A,Vds=30V; Manufacturer: ROHM; Pd: 0.2W; Vgsth: 1.5V; VDS: 30V; Vgs: 20V; Id_max: 0.1A; Priority: A; Rds: 5ohm; Created by: JJJ; Manufacturer PN: 2SK3018; Part Type: NMOS; RK PN: 2SK3018
Q23 = MOSFET N: NMOS,2SK3018,SOT_323,Id=0.1A,Vds=30V; Manufacturer: ROHM; Rds: 5ohm; Priority: A; Id_max: 0.1A; Vgs: 20V; VDS: 30V; Vgsth: 1.5V; Pd: 0.2W; RK PN: 2SK3018; Part Type: NMOS; Manufacturer PN: 2SK3018; Created by: JJJ
R18 R19 R21 R22 = RESISTOR_0: as R167 on sheet 06; Part Type: 通用厚膜电阻; Manufacturer PN: RC0402JR-070RL; Created by: YTL
R20 R26 = RESISTOR_0: as R172 on sheet 06; Created by: YTL; Part Type: 通用厚膜电阻; RK PN: RC0402JR-070RL
R23 = RESISTOR_0: as R168 on sheet 06; Created by: YTL; Part Type: 通用厚膜电阻; RK PN: RC0402JR-0710KL
R24 = RES_0603
R25 = RESISTOR_1
R90396 R90399 = RESISTOR_1: RES,thick film,47KOhm,+/-5%,1/16W,SMD0402
R90398 = RESISTOR_0_Dup1: 通用厚膜电阻,10K,+/-1%,R0402,1/16W.; Manufacturer: YAGEO; Tolerance: 5%; RK PN: RC0402FR-0710KL; Priority: A; Wattage: 1/16W; Part Type: 通用厚膜电阻; Manufacturer PN: RC0402FR-0710KL; Created by: YTL
U3 = HT188_0
*#4 = radxa_1010: Page Create Date: March  8, 1995

## Sheet 08.SchDoc
size 297 x 209 mm
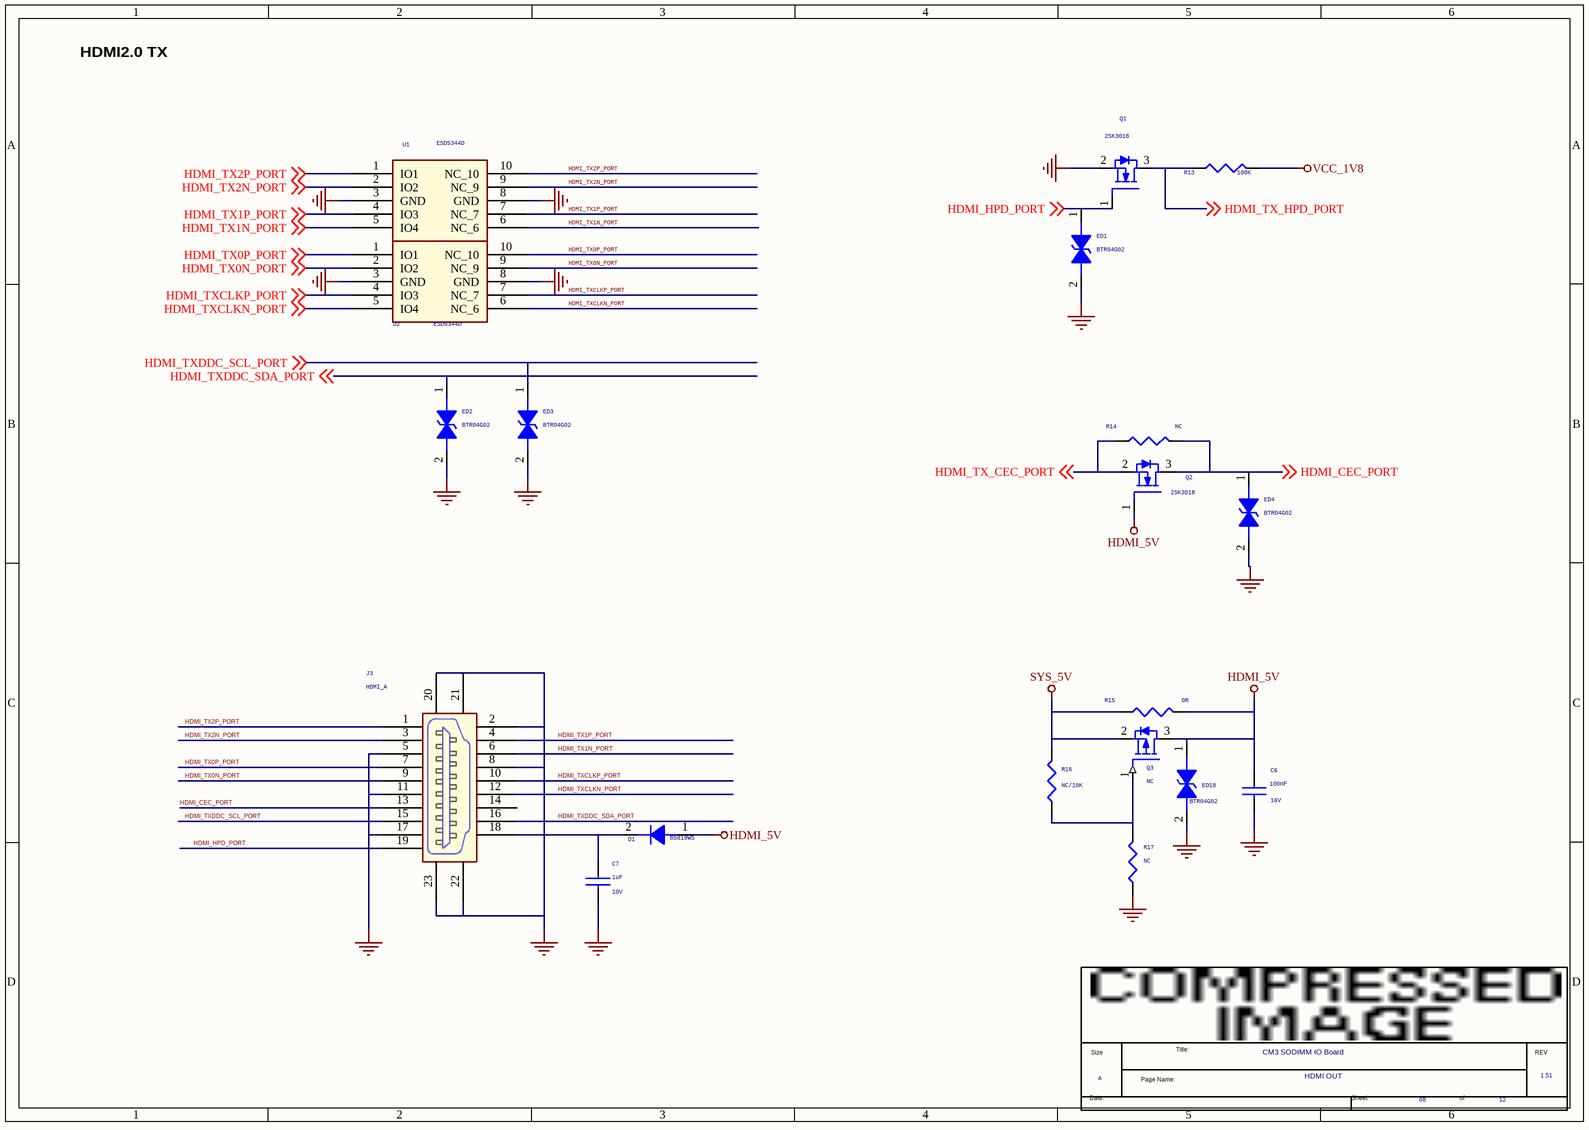
[diagram p4: 08.SchDoc]

### Parts
(Parts that share a designator on the sheet are numbered #1, #2 ... from top to bottom, then left to right.)
*#5  Page Count: 12  Page Number: 08  Page Size: A  Title: CM3 SODIMM IO Board  RevCode: 1.51  Doc: HDMI OUT  (hidden comment: radxa_1010)  (graphical)
C6  100nF  Voltage: 16V  [C0402]
C7  1uF  Voltage: 10V  [C0402]
D1  B5819WS  [SOD_323]
ED1  BTR04G02  [ESD0402_1xD5]
ED2  BTR04G02  [ESD0402_1xD5]
ED3  BTR04G02  [ESD0402_1xD5]
ED4  BTR04G02  [ESD0402_1xD5]
ED18  BTR04G02  [ESD0402_1xD5]
J3  HDMI_A  [HDMIA19S]
Q1  2SK3018  [SOT23]
Q2  2SK3018  [SOT23]
Q3  NC  [SOT23]
R13  100K  [R0402]
R14  NC  [R0402]
R15  0R  [R0402]
R16  NC/10K  [R0402]
R17  NC  [R0402]
U1  ESD5344D  [SON10_2R50X1R00X0R50]
U2  ESD5344D  [SON10_2R50X1R00X0R50]

### Nets
GND: C6.2 C7.2 ED1.2 ED2.2 ED3.2 ED4.2 ED18.2 J3.2 J3.5 J3.8 J3.11 J3.17 J3.20 J3.21 J3.22 J3.23 Q1.2(SOURCE) R17.1 U1.3(GND) U1.8(GND) U2.3(GND) U2.8(GND)
HDMI_5V: C6.1 D1.1(A) ED18.1 Q2.1(GATE) Q3.3(DRAIN) R15.2
SYS_5V: Q3.2(SOURCE) R15.1 R16.2
VCC_1V8: R13.2
HDMI_CEC_PORT: ED4.1 J3.13 Q2.3(DRAIN) R14.2 ; off-sheet HDMI_CEC_PORT
HDMI_HPD_PORT: ED1.1 J3.19 Q1.1(GATE) ; off-sheet HDMI_HPD_PORT
HDMI_TX0N_PORT: J3.9 U2.2(IO2) U2.9(NC_9) ; off-sheet HDMI_TX0N_PORT
HDMI_TX0P_PORT: J3.7 U2.1(IO1) U2.10(NC_10) ; off-sheet HDMI_TX0P_PORT
HDMI_TX1N_PORT: J3.6 U1.5(IO4) U1.6(NC_6) ; off-sheet HDMI_TX1N_PORT
HDMI_TX1P_PORT: J3.4 U1.4(IO3) U1.7(NC_7) ; off-sheet HDMI_TX1P_PORT
HDMI_TX2N_PORT: J3.3 U1.2(IO2) U1.9(NC_9) ; off-sheet HDMI_TX2N_PORT
HDMI_TX2P_PORT: J3.1($PIN0) U1.1(IO1) U1.10(NC_10) ; off-sheet HDMI_TX2P_PORT
HDMI_TX_CEC_PORT: Q2.2(SOURCE) R14.1 ; off-sheet HDMI_TX_CEC_PORT
HDMI_TX_HPD_PORT: Q1.3(DRAIN) R13.1 ; off-sheet HDMI_TX_HPD_PORT
HDMI_TXCLKN_PORT: J3.12 U2.5(IO4) U2.6(NC_6) ; off-sheet HDMI_TXCLKN_PORT
HDMI_TXCLKP_PORT: J3.10 U2.4(IO3) U2.7(NC_7) ; off-sheet HDMI_TXCLKP_PORT
HDMI_TXDDC_SCL_PORT: ED3.1 J3.15 ; off-sheet HDMI_TXDDC_SCL_PORT
HDMI_TXDDC_SDA_PORT: ED2.1 J3.16 ; off-sheet HDMI_TXDDC_SDA_PORT
NetC7_1: C7.1 D1.2(K) J3.18
NetQ3_1: Q3.1(GATE) R16.1 R17.2

Not connected (* = marked no-connect by the designer): J3 14

### Notes on the sheet
- HDMI2.0 TX
- (in symbol radxa_1010) Title:; Size; REV; Page Name:; Date:; Sheet; of

### Library data of the parts
C6 = CAP NP_0: cap,100.00nF,+/-10%,10V,X5R,C0201; Manufacturer PN: C0603X5R1A104K030BC; Manufacturer: TDK; Tolerance: 10%; Priority: A; Dielectric: X5R; Created by: JJJ; Part Type: C0201; RK PN: C0603X5R1A104K030BC
C7 = CAP NP_0: cap,1.00uF,+/-10%,10V,X5R,C0402; Manufacturer: TDK; RK PN: C1005X5R1A105K050BB; Priority: A; Tolerance: 10%; Dielectric: X5R; Part Type: C0402; Manufacturer PN: C1005X5R1A105K050BB; Created by: JJJ
D1 = DIODE_Dup1: Schottky Barrier，B5819WS SOD-323; Manufacturer: 长电; Priority: A; RK PN: B5819WS; Part Type: Schottky rectifier; Manufacturer PN: B5819WS; Created by: JJJ
ED1-ED4 = DIODE BI_DIR TRIG: 1-Line, Bi-directional, Transient Voltage Suppressors.17.5pF.; Manufacturer: WillSemi(韦尔半导体); RK PN: ESD5451N; Priority: A; Part Type: ESD_TVS; Manufacturer PN: ESD5451N; Created by: JJJ
ED18 = DIODE BI_DIR TRIG: 1-Line, Bi-directional, Transient Voltage Suppressors.17.5pF.; Manufacturer PN: ESD5451N; Manufacturer: WillSemi(韦尔半导体); Priority: A; Created by: JJJ; Part Type: ESD_TVS; RK PN: ESD5451N
J3 = HDMI_A: 通用A型HDMI座,卧式,侧插; Manufacturer: 旺科达; Priority: A; RK PN: HDMI_A; Part Type: HDMI Jack; Manufacturer Part Number: HDMI_A; Created by: JJJ
Q1 Q2 = MOSFET N: as Q23 on sheet 07; RK PN: 2SK3018; Part Type: NMOS; Manufacturer PN: 2SK3018; Created by: JJJ
Q3 = MOSFET P: PMOS,WPM2015-3/TR,SOT_23,Id=2.4A,Vds=20V; Manufacturer: WillSemi(韦尔半导体); ROOM: CHG; Priority: A; Id_max: 2.4A; Vgs: ±8V; VDS: 20V; Vgsth: 0.62V; Pd: 0.5W; option: DNP; RK PN: WPM2015-3/TR; Part Type: PMOS; Manufacturer PN: WPM2015-3/TR; Created by: JJJ
R13-R15 = RESISTOR_0: as R167 on sheet 06; Part Type: 通用厚膜电阻; Manufacturer PN: RC0402JR-070RL; Created by: YTL
R16 = RESISTOR_0: as R168 on sheet 06; Created by: YTL; Part Type: 通用厚膜电阻; RK PN: RC0402JR-0710KL
R17 = RESISTOR_0_Dup3
U1 U2 = ESD_ESD5304D: 4-Lines, Uni-directional, Ultra-low Capacitance Transient Voltage Suppressors; Manufacturer: WillSemi(韦尔半导体); Priority: A; RK PN: ESD5304D; Part Type: ESD_TVS; Manufacturer PN: ESD5304D; Created by: JJJ
*#5 = radxa_1010: Page Create Date: March  8, 1995

## Sheet 10.SchDoc
size 386 x 246 mm
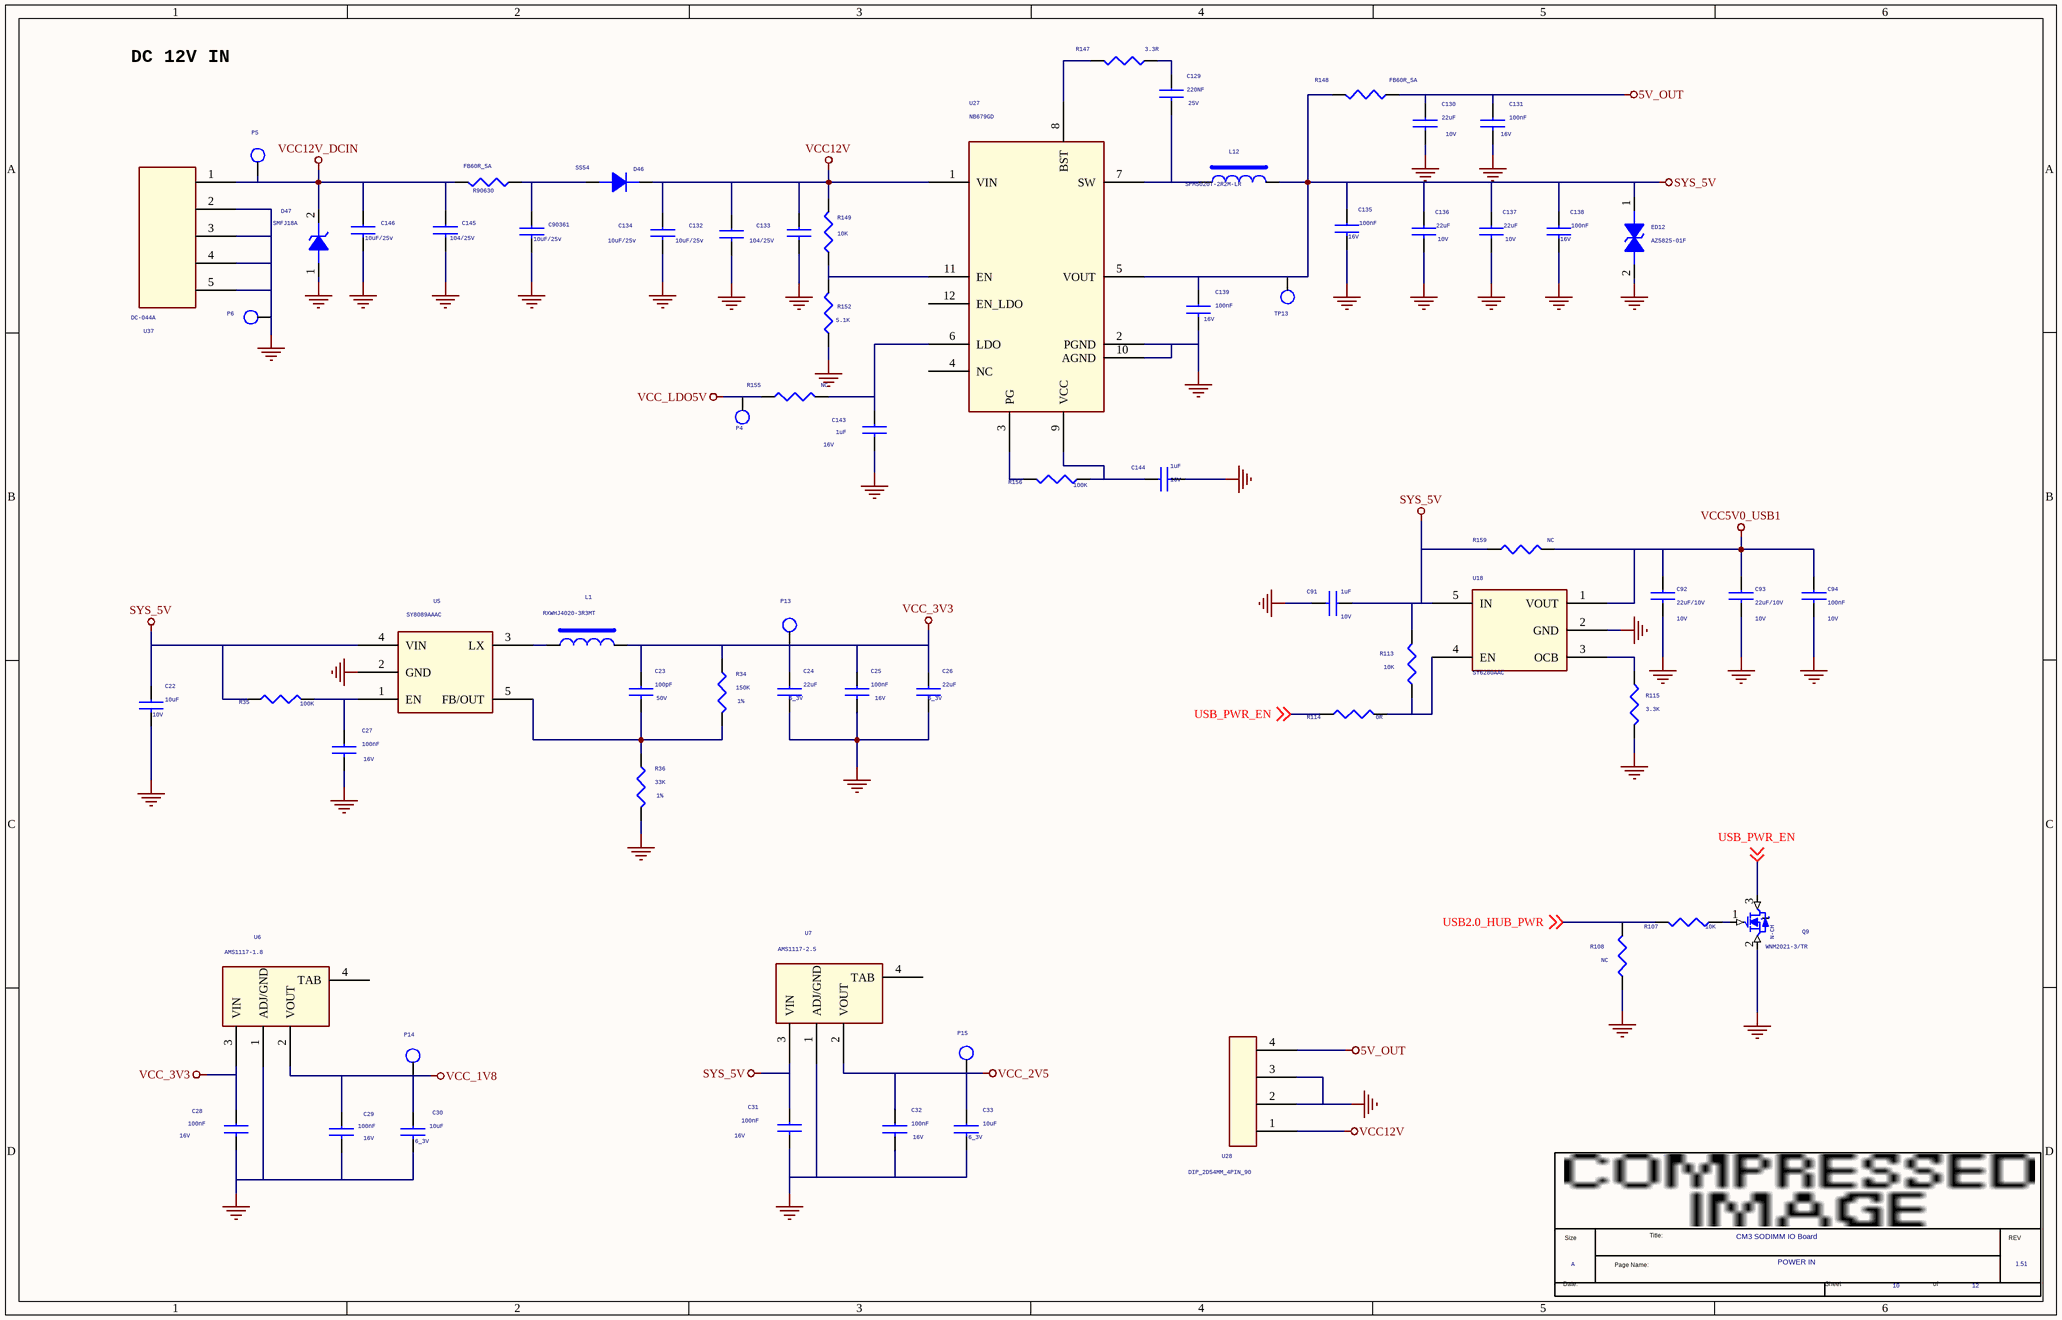
[diagram p5: 10.SchDoc]

### Parts
(Parts that share a designator on the sheet are numbered #1, #2 ... from top to bottom, then left to right.)
*#6  Page Count: 12  Page Number: 10  Page Size: A  Title: CM3 SODIMM IO Board  RevCode: 1.51  Doc: POWER IN  (hidden comment: radxa_1010)  (graphical)
C22  10uF  Voltage: 10V  [C0603]
C23  100pF  Voltage: 50V  [C0402]
C24  22uF  Voltage: 6_3V  [C0603]
C25  100nF  Voltage: 16V  [C0402]
C26  22uF  Voltage: 6_3V  [C0603]
C27  100nF  Voltage: 16V  [C0402]
C28  100nF  Voltage: 16V  [C0402]
C29  100nF  Voltage: 16V  [C0402]
C30  10uF  Voltage: 6_3V  [C0603]
C31  100nF  Voltage: 16V  [C0402]
C32  100nF  Voltage: 16V  [C0402]
C33  10uF  Voltage: 6_3V  [C0603]
C91  1uF  Voltage: 10V  [C0402]
C92  22uF/10V  Voltage: 10V  [C0603]
C93  22uF/10V  Voltage: 10V  [C0603]
C94  100nF  Voltage: 10V  [C0402]
C129  220NF  Voltage: 25V  [C0402]
C130  22uF  Voltage: 10V  [C0603]
C131  100nF  Voltage: 16V  [C0402]
C132  10uF/25v  [C0805]
C133  104/25V  [C0402]
C134  10uF/25v  [C0805]
C135  100nF  Voltage: 16V  [C0402]
C136  22uF  Voltage: 10V  [C0603]
C137  22uF  Voltage: 10V  [C0603]
C138  100nF  Voltage: 16V  [C0402]
C139  100nF  Voltage: 16V  [C0402]
C143  1uF  Voltage: 16V  [C0402]
C144  1uF  Voltage: 16V  [C0402]
C145  104/25V  [C0402]
C146  10uF/25v  [C0805]
C90361  10uF/25v  [C0805]
D46  SS54  [DO_214AC]
D47  SMFJ18A  [SOD_123]
ED12  AZ5825-01F  [ESD0402]
L1  RXWHJ4020-3R3MT  [IND-4X4]
L12  SPM5020T-2R2M-LR  [IND-5020]
P4  TEST  [TEST]  (value not drawn)
P5  TEST  [TEST]  (value not drawn)
P6  TEST  [TEST]  (value not drawn)
P13  TEST  [TEST]  (value not drawn)
P14  TEST  [TEST]  (value not drawn)
P15  TEST  [TEST]  (value not drawn)
Q9  WNM2021-3/TR  [S0T-23]
R34  150K  Tolerance: 1%  [R0402]
R35  100K  [R0402]
R36  33K  Tolerance: 1%  [R0402]
R107  10K  [R0402]
R108  NC  [R0402]
R113  10K  [R0402]
R114  0R  [R0402]
R115  3.3K  [R0402]
R147  3.3R  [R0402]
R148  FB60R_5A  [R1206]
R149  10K  [R0402]
R152  5.1K  [R0402]
R155  NC  [R0402]
R156  100K  [R0402]
R159  NC  [R0402]
R90630  FB60R_5A  [R1206]
TP13  TP_0.7  [TEST]  (value not drawn)
U5  SY8089AAAC  [SOT_23_5]
U6  AMS1117-1.8  [SOT-223]
U7  AMS1117-2.5  [SOT-223]
U18  SY6280AAC  [SOT_23_5]
U27  NB679GD  [QFN12_3R00X2R00X0R90]
U28  DIP_2D54MM_4PIN_90  [XIAO_4PIN_2D54]
U37  DC-044A  [DC-044A]

### Nets
5V_OUT: C130.1 C131.1 R148.1 U28.4
GND: C22.2 C24.2 C25.2 C26.2 C27.2 C28.2 C29.2 C30.2 C31.2 C32.2 C33.2 C91.2 C92.2 C93.2 C94.2 C130.2 C131.2 C132.2 C133.2 C134.2 C135.2 C136.2 C137.2 C138.2 C139.2 C143.2 C144.2 C145.2 C146.2 C90361.2 D47.1(ANODE) ED12.2 P6.1 Q9.2(S) R36.2 R108.2 R115.2 R152.1 U5.2(GND) U6.1(ADJ/GND) U7.1(ADJ/GND) U18.2(GND) U27.2(PGND) U27.10(AGND) U28.2 U28.3 U37.2 U37.3 U37.4 U37.5
SYS_5V: C22.1 C31.1 C91.1 C135.1 C136.1 C137.1 C138.1 C139.1 ED12.1 L12.2 R35.1 R113.1 R148.2 R159.1 TP13.1 U5.4(VIN) U7.3(VIN) U18.5(IN) U27.5(VOUT)
VCC5V0_USB1: C92.1 C93.1 C94.1 R159.2 U18.1(VOUT)
VCC12V: C132.1 C133.1 C134.1 D46.2(K) R149.2 U27.1(VIN) U28.1
VCC12V_DCIN: C145.1 C146.1 D47.2(CATHODE) P5.1 R90630.2 U37.1
VCC_1V8: C29.1 C30.1 P14.1 U6.2(VOUT)
VCC_2V5: C32.1 C33.1 P15.1 U7.2(VOUT)
VCC_3V3: C23.1 C24.1 C25.1 C26.1 C28.1 L1.2 P13.1 R34.1 U6.3(VIN)
VCC_LDO5V: P4.1 R155.1
USB2.0_HUB_PWR: R107.2 R108.1 ; off-sheet USB2.0_HUB_PWR
USB_PWR_EN: Q9.3(D) R114.2 ; off-sheet USB_PWR_EN
NetC23_2: C23.2 R34.2 R36.1 U5.5(FB/OUT)
NetC27_1: C27.1 R35.2 U5.1(EN)
NetC129_1: C129.1 R147.2
NetC129_2: C129.2 L12.1 U27.7(SW)
NetC143_1: C143.1 R155.2 U27.6(LDO)
NetC144_1: C144.1 R156.2 U27.9(VCC)
NetC90361_1: C90361.1 D46.1(A) R90630.1
NetL1_1: L1.1 U5.3(LX)
NetQ9_1: Q9.1(G) R107.1
NetR113_2: R113.2 R114.1 U18.4(EN)
NetR115_1: R115.1 U18.3(OCB)
NetR147_1: R147.1 U27.8(BST)
NetR149_1: R149.1 R152.2 U27.11(EN)
NetR156_1: R156.1 U27.3(PG)

Not connected (* = marked no-connect by the designer): U6 4(TAB); U7 4(TAB); U27 4(NC) 12(EN_LDO)

### Notes on the sheet
- DC 12V IN
- (in symbol N-MOSFET) N-CH
- (in symbol radxa_1010) Size; Title:; REV; Page Name:; Date:; Sheet; of

### Library data of the parts
C22 = CAP NP_0: cap,10.00uF,+/-10%,10V,X5R,C0805; Manufacturer PN: C2012X5R1A106K125AB; Manufacturer: TDK; Tolerance: 10%; C_Voltage: 6.3V; Priority: A; Dielectric: X5R; Created by: JJJ; Part Type: C0805; RK PN: C2012X5R1A106K125AB
C23 = CAP NP_0: cap,100.00pF,+/-10%,50V,C0G,C0402; Manufacturer PN: C1005C0G1H101K050BA; Manufacturer: TDK; C_Voltage: 6.3V; Tolerance: 10%; Priority: A; Number: 37; Dielectric: C0G; Created by: JJJ; Part Type: C0402; RK PN: C1005C0G1H101K050BA
C24 C33 = CAP NP_0: cap,10.00uF,+/-10%,6.3V,X5R,C0603; Manufacturer PN: C1608X5R0J106K080AB; Manufacturer: TDK; Tolerance: 10%; Priority: A; Dielectric: X5R; Created by: JJJ; C_Voltage: 6.3V; Part Type: C0603; RK PN: C1608X5R0J106K080AB
C25 C28 C135 C138 = CAP NP_0: as C9 on sheet 07; Dielectric: X5R; Part Type: C0402; Manufacturer PN: C1005X5R1C104K050BA; Created by: JJJ
C26 C30 = CAP NP_0: cap,10.00uF,+/-10%,6.3V,X5R,C0603; Manufacturer: TDK; RK PN: C1608X5R0J106K080AB; Priority: A; Tolerance: 10%; Dielectric: X5R; Part Type: C0603; C_Voltage: 6.3V; Manufacturer PN: C1608X5R0J106K080AB; Created by: JJJ
C27 C29 C31 C32 C131 C139 = CAP NP_0: as C164 on sheet 06; Dielectric: X5R; Created by: JJJ; Part Type: C0402; RK PN: C1005X5R1C104K050BA
C91 = CAP NP_0: cap,1.00uF,+/-10%,10V,X5R,C0402; Manufacturer PN: C1005X5R1A105K050BB; Manufacturer: TDK; Tolerance: 10%; C_Voltage: 6.3V; Priority: A; Dielectric: X5R; Created by: JJJ; Part Type: C0402; RK PN: C1005X5R1A105K050BB
C92 C93 = CAP NP_0: cap,100.00nF,+/-10%,10V,X5R,C0402; Manufacturer PN: C1005X5R1A104K050BA; Manufacturer: TDK; Tolerance: 10%; Priority: A; Dielectric: X5R; Created by: JJJ; Part Type: C0402; RK PN: C1005X5R1A104K050BA
C94 = CAP NP_0: cap,100.00nF,+/-10%,10V,X5R,C0402; Manufacturer: TDK; RK PN: C1005X5R1A104K050BA; Priority: A; Tolerance: 10%; Dielectric: X5R; Part Type: C0402; Manufacturer PN: C1005X5R1A104K050BA; Created by: JJJ
C129 = CAP NP_0: cap,220.00nF,+/-10%,25V,X5R,C0402; Manufacturer: TDK; RK PN: C1005X5R1E224K050BC; Priority: A; Tolerance: 10%; Dielectric: X5R; Part Type: C0402; Manufacturer PN: C1005X5R1E224K050BC; Created by: JJJ
C130 = CAP NP_0: cap,22.00uF,+/-10%,10V,X5R,C0805; Manufacturer: TDK; RK PN: C2012X5R1A226K125AB; Priority: A; Tolerance: 10%; Dielectric: X5R; Part Type: C0805; Manufacturer PN: C2012X5R1A226K125AB; Created by: JJJ
C132 C134 C146 C90361 = CAP NP_0: cap,10.00uF,+/-10%,16V,X5R,C0805; Manufacturer: TDK; RK PN: C2012X5R1C106K125AC; Priority: A; Tolerance: 10%; Dielectric: X5R; Voltage: 16V; Part Type: C0805; Manufacturer PN: C2012X5R1C106K125AC; Created by: JJJ
C133 = CAP NP_0: cap,1.00uF,+/-10%,16V,X5R,C0402; Manufacturer PN: C1005X5R1C105K050BC; Manufacturer: TDK; Voltage: 25V; Tolerance: 10%; Priority: A; Dielectric: X5R; Created by: JJJ; Part Type: C0402; RK PN: C1005X5R1C105K050BC
C136 C137 = CAP NP_0: as C163 on sheet 06; Dielectric: X5R; Created by: JJJ; Part Type: C0805; RK PN: C2012X5R1A226K125AB
C143 C144 = CAP NP_0: cap,1.00uF,+/-10%,16V,X5R,C0402; Manufacturer PN: C1005X5R1C105K050BC; Manufacturer: TDK; Tolerance: 10%; Priority: A; Dielectric: X5R; Created by: JJJ; Part Type: C0402; RK PN: C1005X5R1C105K050BC
C145 = CAP NP_0: cap,1.00uF,+/-10%,16V,X5R,C0402; Manufacturer: TDK; Voltage: 25V; RK PN: C1005X5R1C105K050BC; Priority: A; Tolerance: 10%; Dielectric: X5R; Part Type: C0402; Manufacturer PN: C1005X5R1C105K050BC; Created by: JJJ
D46 = DIODE: Schottky Barrier，SS32 DO214AC; Manufacturer PN: SS32; Manufacturer: 星海; Priority: A; ROOM: CHG; Created by: JJJ; Part Type: Schottky rectifier; RK PN: SS32
D47 = DIODE ZENER1: 1-Line, Uni-directional, Transient Voltage Suppressor; Manufacturer PN: ESD5621W-2/TR; Manufacturer: WillSemi(韦尔半导体); Priority: A; Created by: JJJ; Part Type: ESD_TVS; RK PN: ESD5621W-2/TR
ED12 = DIODE BI_DIR TRIG: Transient Voltage Suppressing Device.Tiny Packge for ESD/Transient Protection; Manufacturer: Amazing（晶焱科技）; Priority: A; RK PN: AZ5825-01F; Part Type: ESD_TVS; Manufacturer PN: AZ5825-01F; Created by: JJJ
L1 = INDUCTORS OF FERRITE_Dup1: Power Inductor,3.3uH,0.2,IND_303015; Manufacturer: sunlord; Isat: 1.32A; DC Resistor: 0.08ohm; RK PN: SWPA3015S3R3MT; Priority: A; Tolerance: 20%; Irms: 1.36A; Resonace frequency: 68M; Part Type: POWER_IND; Manufacturer PN: SWPA3015S3R3MT; Created by: YTL
L12 = INDUCTORS OF FERRITE
P4-P6 P13-P15 = TESTPOINT1
Q9 = N-MOSFET: SANZ_P/N: SK2300; Part Type: MOS管
R34 = RESISTOR_0: 通用厚膜电阻,150K,+/-1%,R0402,1/16W.; Manufacturer: YAGEO; RK PN: RC0402FR-07150KL; Priority: A; Wattage: 1/16W; Part Type: 通用厚膜电阻; Manufacturer PN: RC0402FR-07150KL; Created by: YTL
R35 = RESISTOR_0: 通用厚膜电阻,330K,+/-5%,R0402,1/16W.; Manufacturer PN: RC0402JR-07330KL; Manufacturer: YAGEO; Tolerance: 5%; Wattage: 1/16W; Priority: A; Created by: YTL; Part Type: 通用厚膜电阻; RK PN: RC0402JR-07330KL
R36 = RESISTOR_0: 通用厚膜电阻,33K,+/-1%,R0402,1/16W.; Manufacturer PN: RC0402FR-0733KL; Manufacturer: YAGEO; Wattage: 1/16W; Priority: A; Created by: YTL; Part Type: 通用厚膜电阻; RK PN: RC0402FR-0733KL
R107 = RESISTOR_1: as R90396 on sheet 07
R108 = RESISTOR_0_Dup3: RES,thick film,47KOhm,+/-5%,1/16W,SMD0402; MARK: 51K
R113 = RESISTOR_0: 通用厚膜电阻,4K7,+/-5%,R0402,1/16W.; Manufacturer: YAGEO; Tolerance: 5%; RK PN: RC0402JR-074K7L; Priority: A; Wattage: 1/16W; Part Type: 通用厚膜电阻; Manufacturer PN: RC0402JR-074K7L; Created by: YTL
R114 = RESISTOR_0: as R172 on sheet 06; Created by: YTL; Part Type: 通用厚膜电阻; RK PN: RC0402JR-070RL
R115 = RESISTOR_0: as R176 on sheet 06; Created by: YTL; Part Type: 通用厚膜电阻; RK PN: RC0402JR-074K7L
R147 = RESISTOR_0: 通用厚膜电阻,3R3,+/-5%,R0402,1/16W.; Manufacturer PN: RC0402JR-073R3L; Manufacturer: YAGEO; Tolerance: 5%; Wattage: 1/16W; Priority: A; Created by: YTL; Part Type: 通用厚膜电阻; RK PN: RC0402JR-073R3L
R148 R90630 = R_0
R149 R152 = RESISTOR_0: as R168 on sheet 06; Created by: YTL; Part Type: 通用厚膜电阻; RK PN: RC0402JR-0710KL
R155 R159 = RESISTOR_2: 通用厚膜电阻,10K,+/-5%,R0402,1/16W.; Manufacturer: YAGEO; Tolerance: 5%; RK PN: RC0402JR-0710KL; Priority: A; Wattage: 1/16W; Part Type: 通用厚膜电阻; Manufacturer PN: RC0402JR-0710KL; Created by: YTL
R156 = RESISTOR_0: 通用厚膜电阻,100K,+/-5%,R0402,1/16W.; Manufacturer: YAGEO; Tolerance: 5%; RK PN: RC0402JR-07100KL; Priority: A; Wattage: 1/16W; Part Type: 通用厚膜电阻; Manufacturer PN: RC0402JR-07100KL; Created by: YTL
TP13 = TP: Test Point 0.7mm; Priority: A; RK PN: TESTPOINT_0R7; Created by: JJJ; Part Type: TP
U5 = DCDC_SY8088: 1A, 1.5MHz Step-Down Converter in SOT23-5 Package; Manufacturer PN: ETA3486; option: /SY8088AAC/PT3406; Priority: A; Created by: JJJ; Part Type: DCDC; RK PN: ETA3486
U6 U7 = CON3_2_Dup1
U18 = SWITCH_SY6280: Low Loss Power Distribution Switch; Manufacturer: Silergy（矽力杰）; Priority: A; RK PN: SY6280AAC; Part Type: Switch; Manufacturer PN: SY6280AAC; Created by: JJJ
U27 = DCDC_NB679: 26 V, Low Iq, High Current, Fixed 5 V-8 A Synchronous Buck Converter with 100 mA LDO;; Manufacturer: MPS （美国芯源）; RK PN: NB679GD; Priority: A; Part Type: DCDC; Manufacturer PN: NB679GD; Created by: JJJ
U28 = CON3_2
U37 = CON3_6
*#6 = radxa_1010: Page Create Date: March  8, 1995

## Nets that join several sheets
GND: 04 (19 pins), 06 (46 pins), 07 (35 pins), 08 (22 pins), 10 (50 pins)
SYS_5V: 08 (Q3.2 R15.1 R16.2), 10 (19 pins)
VCC12V: 06 (12 pins), 10 (7 pins)
VCC_1V8: 08 (R13.2), 10 (C29.1 C30.1 P14.1 U6.2)
VCC_3V3: 04 (7 pins), 06 (5 pins), 07 (7 pins), 10 (9 pins)